# EAGLE design master-v13 (EAGLE 7.1.0)
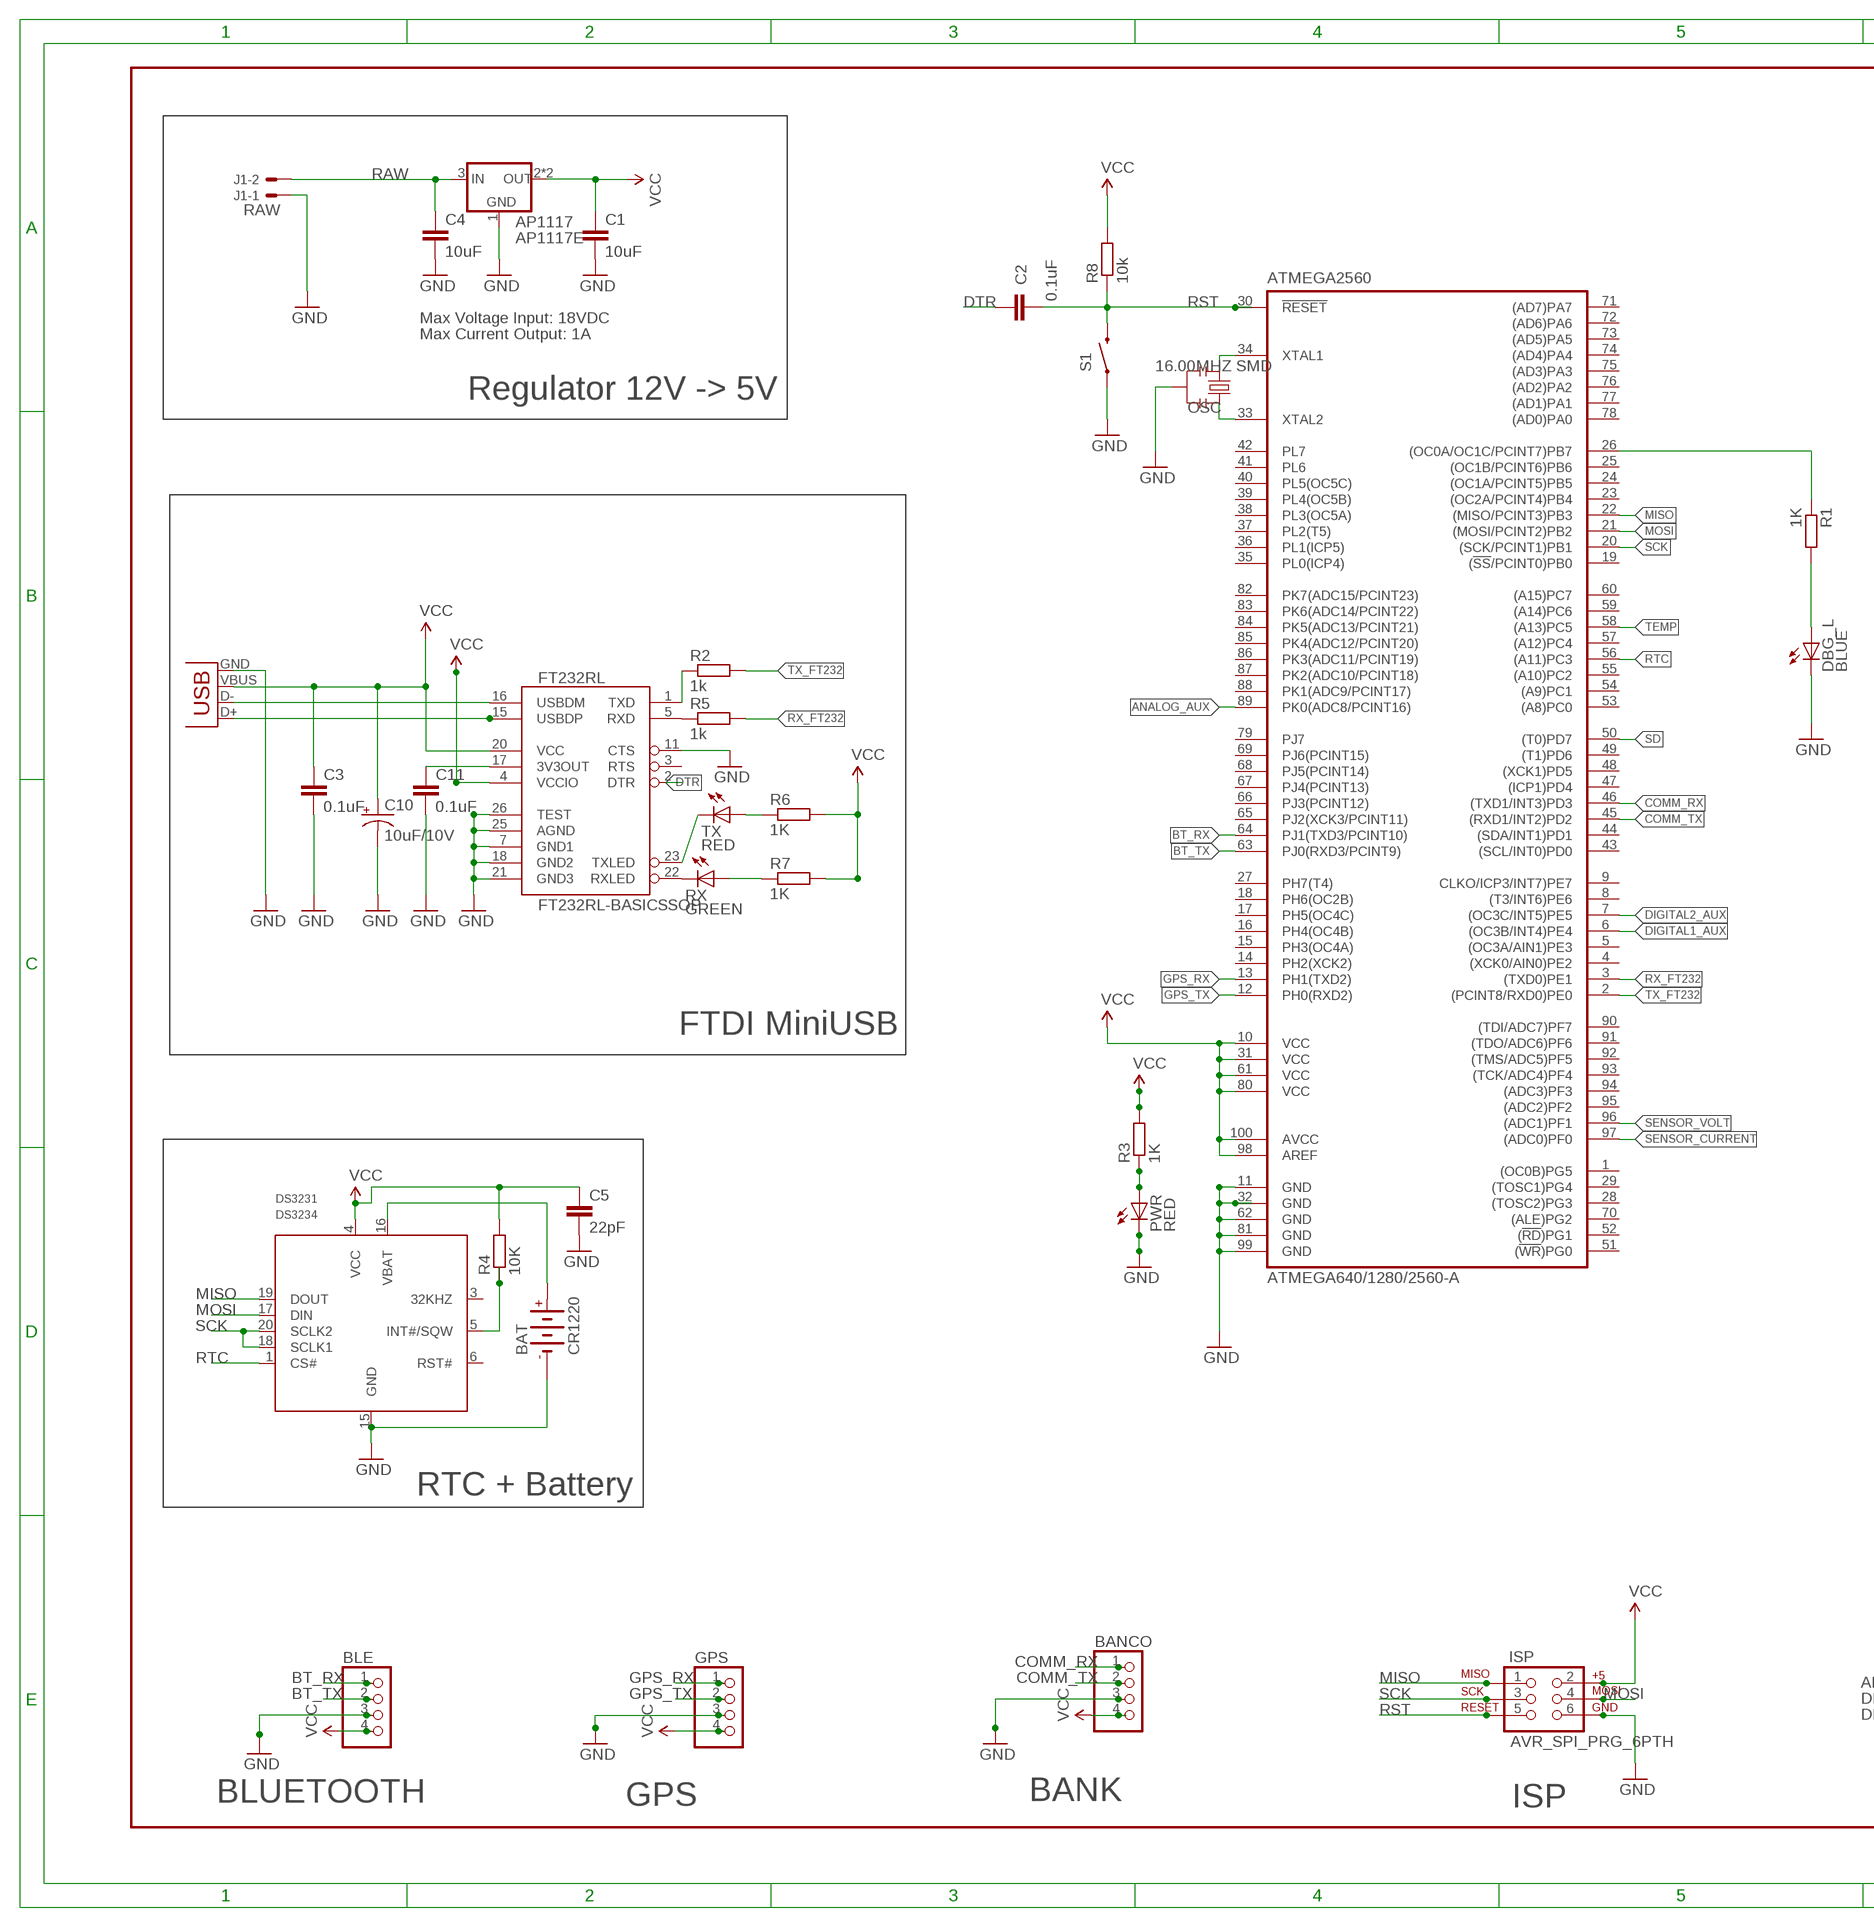
[diagram p0: schematic, sheet 1, part 1 of 2]
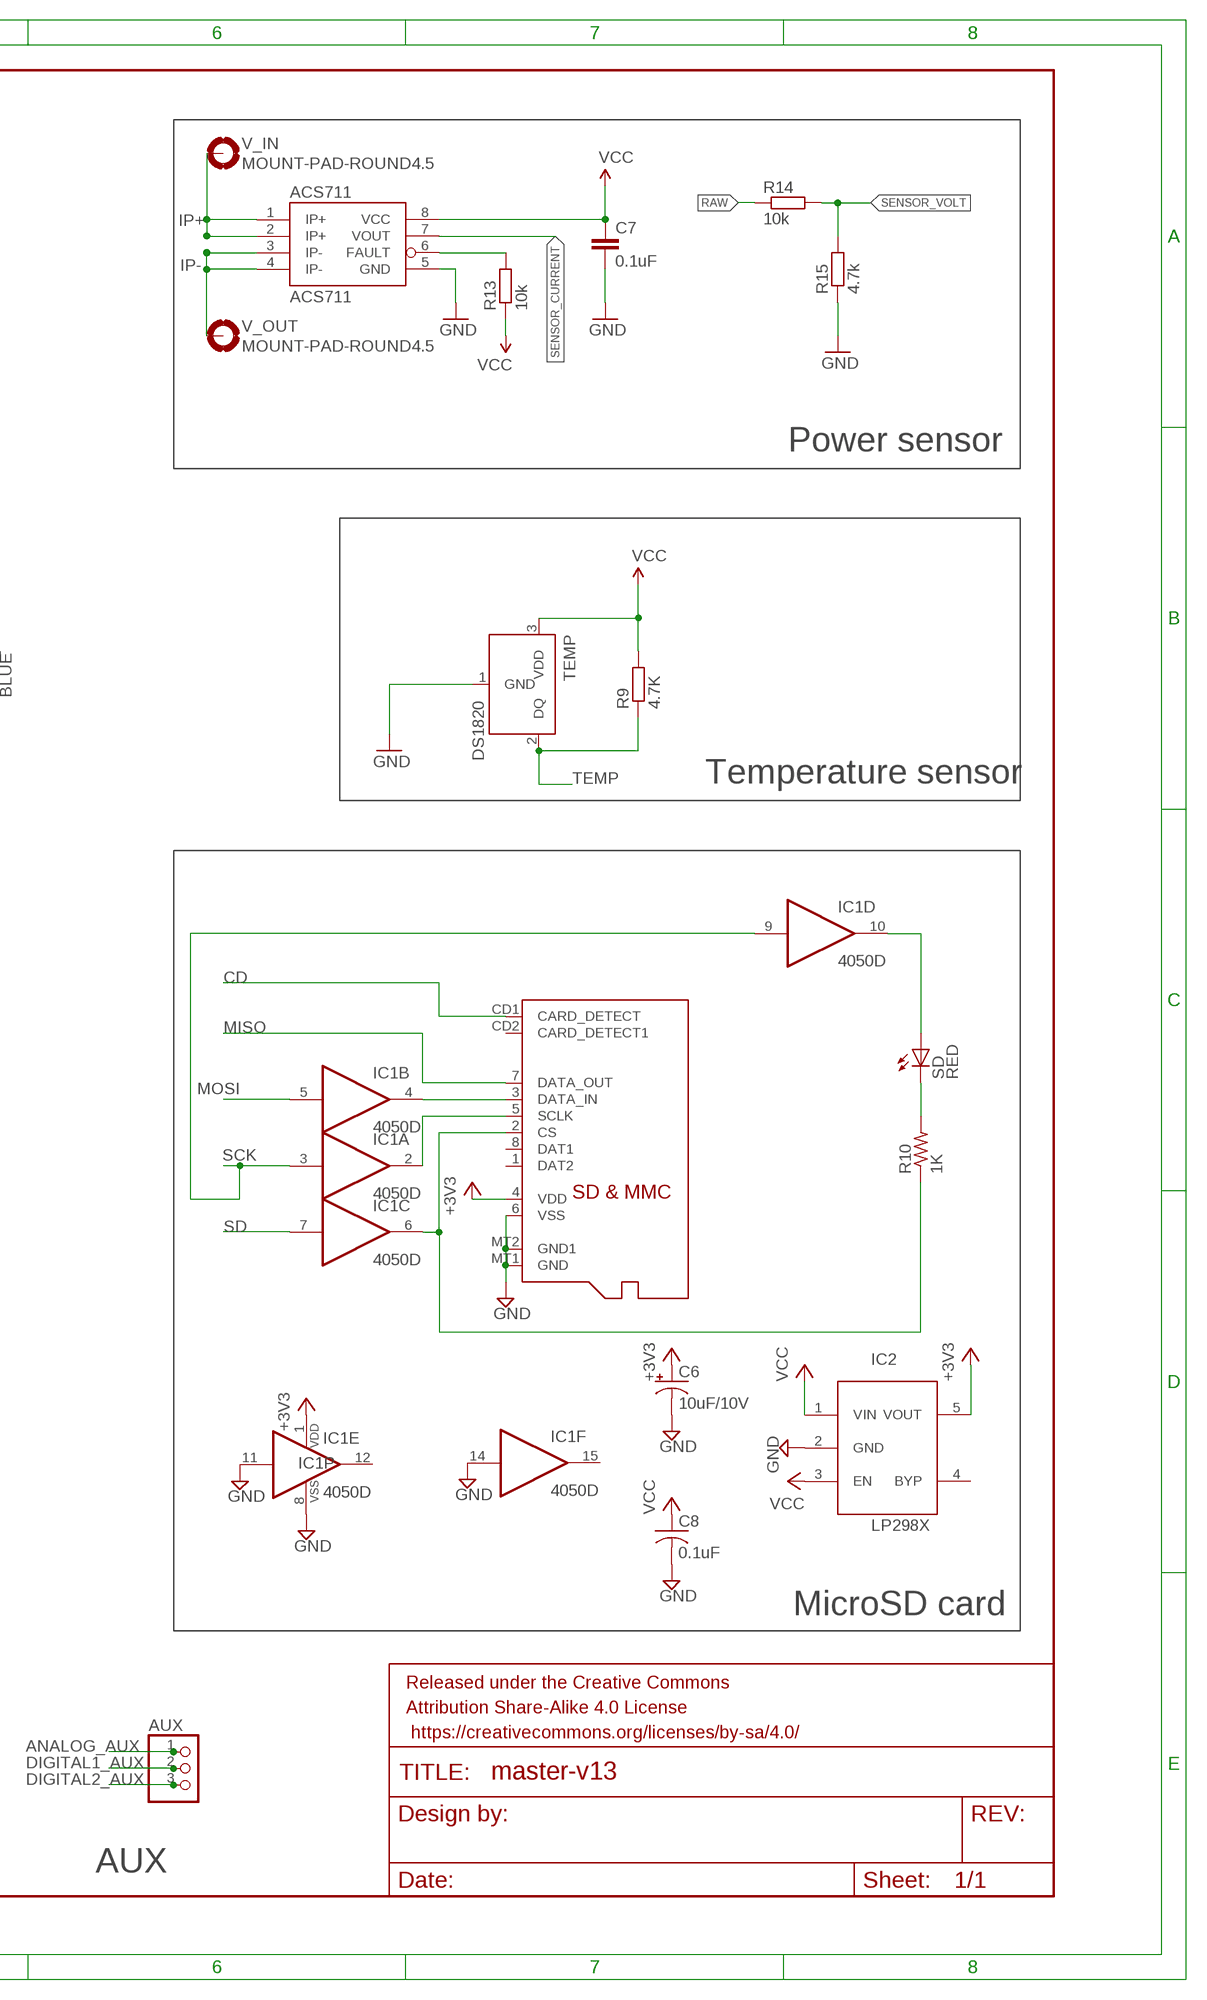
[diagram p1: schematic, sheet 1, part 2 of 2]

## Parts
ACS711  ACS711  [SOIC8]
AP1117  AP1117E  [SOT223]
ATMEGA2560  ATMEGA640/1280/2560-A  [TQFP100A]
AUX  PINHD-1X3  [1X03]
BANCO  PINHD-1X4  [1X04]
BAT  CR1220  [CR1220]
BLE  PINHD-1X4  [1X04]
C1  10uF  C-EUC0805K  [C0805K]
C2  0.1uF  C-EUC0805K  [C0805K]
C3  0.1uF  CAP0402-CAP  [0402-CAP]
C4  10uF  C-EUC0805K  [C0805K]
C5  22pF  CAP0402-CAP  [0402-CAP]
C6  10uF/10V  CPOL-USA/3216-18R  [A/3216-18R]
C7  0.1uF  C-EUC0805K  [C0805K]
C8  0.1uF  C-USC0805K  [C0805K]
C10  10uF/10V  CPOL-USA/3216-18R  [A/3216-18R]
C11  0.1uF  CAP0402-CAP  [0402-CAP]
DBG_L  BLUE  LEDCHIPLED_0805  [CHIPLED_0805]
DS3231  DS3234  [SO-20DW]
FRAME1  FRAME-LEDGER  [CREATIVE_COMMONS]
FT232RL  FT232RL-BASICSSOP  [SSOP28DB]
GPS  PINHD-1X4  [1X04]
IC1  4050D  [SO16]
IC2  LP298XS  [SOT23-5L]
ISP  AVR_SPI_PRG_6PTH  [2X3]
J1  RAW  22-05-7028-02  [7395-02]
OSC  16.00MHZ SMD  RESONATOR-SMD  [RESONATOR-SMD]
PWR  RED  LEDCHIPLED_0805  [CHIPLED_0805]
R1  1K  R-EU_R0805  [R0805]
R2  1k  R-EU_R0805  [R0805]
R3  1K  R-EU_R0805  [R0805]
R4  10K  R-EU_R0805  [R0805]
R5  1k  R-EU_R0805  [R0805]
R6  1K  R-EU_R0805  [R0805]
R7  1K  R-EU_R0805  [R0805]
R8  10k  R-EU_R0805  [R0805]
R9  4.7K  R-EU_R0805  [R0805]
R10  1K  R-US_R0805  [R0805]
R13  10k  R-EU_R0805  [R0805]
R14  10k  R-EU_R0805  [R0805]
R15  4.7k  R-EU_R0805  [R0805]
RX  GREEN  LEDCHIPLED_0805  [CHIPLED_0805]
S1  SWITCH-MOMENTARY-2-SMD-1101NE  [TACTILE-SWITCH-1101NE]
SD  RED  LEDCHIP-LED0805  [CHIP-LED0805]
TEMP  DS1820  [TO-92]
TX  RED  LEDCHIPLED_0805  [CHIPLED_0805]
V_IN  MOUNT-PAD-ROUND4.5  [4,5-PAD]
V_OUT  MOUNT-PAD-ROUND4.5  [4,5-PAD]
X1  USB-MB-H  [USB-MB-H]
X2  MICROSD  [MICROSD]

## Nets
+3V3: C6.+ IC1.1(P:VDD) IC2.5(VOUT) X2.4(VDD)
ANALOG_AUX: ATMEGA2560.89(PK0(ADC8/PCINT16)) AUX.1
BT_RX: ATMEGA2560.64(PJ1(TXD3/PCINT10)) BLE.1
BT_TX: ATMEGA2560.63(PJ0(RXD3/PCINT9)) BLE.2
CD: X2.CD1(CARD_DETECT)
COMM_RX: ATMEGA2560.46((TXD1/INT3)PD3) BANCO.1
COMM_TX: ATMEGA2560.45((RXD1/INT2)PD2) BANCO.2
DIGITAL1_AUX: ATMEGA2560.6((OC3B/INT4)PE4) AUX.2
DIGITAL2_AUX: ATMEGA2560.7((OC3C/INT5)PE5) AUX.3
DTR: C2.2 FT232RL.2(DTR)
GND [power]: ACS711.5(GND) AP1117.1(GND) ATMEGA2560.11(GND) ATMEGA2560.32(GND) ATMEGA2560.62(GND) ATMEGA2560.81(GND) ATMEGA2560.99(GND) BANCO.3 BAT.- BLE.3 C1.2 C3.2 C4.2 C5.2 C6.- C7.2 C8.2 C10.- C11.2 DBG_L.C DS3231.15(GND) FT232RL.7(GND1) FT232RL.11(CTS) FT232RL.18(GND2) FT232RL.21(GND3) FT232RL.25(AGND) FT232RL.26(TEST) GPS.3 IC1.8(P:VSS) IC1.11(E:I) IC1.14(F:I) IC2.2(GND) ISP.6 J1.1 OSC.2 PWR.C R15.1 S1.P$1 TEMP.1(GND) X1.GND X2.6(VSS) X2.MT1(GND) X2.MT2(GND1)
GPS_RX: ATMEGA2560.13(PH1(TXD2)) GPS.1
GPS_TX: ATMEGA2560.12(PH0(RXD2)) GPS.2
IP+: ACS711.1(IP+) ACS711.2(IP+) V_IN.B4,5(MOUNT)
IP-: ACS711.3(IP-) ACS711.4(IP-) V_OUT.B4,5(MOUNT)
MISO: ATMEGA2560.22((MISO/PCINT3)PB3) DS3231.19(DOUT) ISP.1 X2.7(DATA_OUT)
MOSI: ATMEGA2560.21((MOSI/PCINT2)PB2) DS3231.17(DIN) IC1.5(B:I) ISP.4
N$1: BAT.+ DS3231.16(VBAT)
N$2: ATMEGA2560.34(XTAL1) OSC.1
N$3: DBG_L.A R1.2
N$4: ATMEGA2560.26((OC0A/OC1C/PCINT7)PB7) R1.1
N$5: PWR.A R3.1
N$6: FT232RL.1(TXD) R2.1
N$7: DS3231.5(INT#/SQW) R4.1
N$8: FT232RL.5(RXD) R5.1
N$9: IC1.10(D:O) SD.A
N$10: FT232RL.22(RXLED) RX.C
N$11: R7.1 RX.A
N$12: FT232RL.23(TXLED) TX.C
N$13: R6.1 TX.A
N$14: ATMEGA2560.33(XTAL2) OSC.3
N$15: IC1.2(A:O) X2.5(SCLK)
N$16: IC1.6(C:O) R10.1 X2.2(CS)
N$17: R10.2 SD.C
N$18: IC1.4(B:O) X2.3(DATA_IN)
N$19 [power]: C11.1 FT232RL.17(3V3OUT)
N$69: ACS711.6(FAULT) R13.2
RAW [power]: AP1117.3(IN) C4.1 J1.2 R14.1
RST: ATMEGA2560.30(!RESET!) C2.1 ISP.5 R8.1 S1.P$2
RTC: ATMEGA2560.56((A11)PC3) DS3231.1(CS#)
RX_FT232: ATMEGA2560.3((TXD0)PE1) R5.2
SCK: ATMEGA2560.20((SCK/PCINT1)PB1) DS3231.18(SCLK1) DS3231.20(SCLK2) IC1.3(A:I) IC1.9(D:I) ISP.3
SD: ATMEGA2560.50((T0)PD7) IC1.7(C:I)
SENSOR_CURRENT: ACS711.7(VOUT) ATMEGA2560.97((ADC0)PF0)
SENSOR_VOLT: ATMEGA2560.96((ADC1)PF1) R14.2 R15.2
TEMP: ATMEGA2560.58((A13)PC5) R9.1 TEMP.2(DQ)
TX_FT232: ATMEGA2560.2((PCINT8/RXD0)PE0) R2.2
USB_D+1: FT232RL.15(USBDP) X1.D+
USB_D-1: FT232RL.16(USBDM) X1.D-
VCC [power]: ACS711.8(VCC) AP1117.2(OUT) AP1117.4(OUT) ATMEGA2560.10(VCC) ATMEGA2560.31(VCC) ATMEGA2560.61(VCC) ATMEGA2560.80(VCC) ATMEGA2560.98(AREF) ATMEGA2560.100(AVCC) BANCO.4 BLE.4 C1.1 C3.1 C5.1 C7.1 C8.1 C10.+ DS3231.4(VCC) FT232RL.4(VCCIO) FT232RL.20(VCC) GPS.4 IC2.1(VIN) IC2.3(EN) ISP.2 R3.2 R4.2 R6.2 R7.2 R8.2 R9.2 R13.1 TEMP.3(VDD) X1.VBUS
Unconnected: ATMEGA2560.1((OC0B)PG5) ATMEGA2560.4((XCK0/AIN0)PE2) ATMEGA2560.5((OC3A/AIN1)PE3) ATMEGA2560.8((T3/INT6)PE6) ATMEGA2560.9(CLKO/ICP3/INT7)PE7) ATMEGA2560.14(PH2(XCK2)) ATMEGA2560.15(PH3(OC4A)) ATMEGA2560.16(PH4(OC4B)) ATMEGA2560.17(PH5(OC4C)) ATMEGA2560.18(PH6(OC2B)) ATMEGA2560.19((!SS!/PCINT0)PB0) ATMEGA2560.23((OC2A/PCINT4)PB4) ATMEGA2560.24((OC1A/PCINT5)PB5) ATMEGA2560.25((OC1B/PCINT6)PB6) ATMEGA2560.27(PH7(T4)) ATMEGA2560.28((TOSC2)PG3) ATMEGA2560.29((TOSC1)PG4) ATMEGA2560.35(PL0(ICP4)) ATMEGA2560.36(PL1(ICP5)) ATMEGA2560.37(PL2(T5)) ATMEGA2560.38(PL3(OC5A)) ATMEGA2560.39(PL4(OC5B)) ATMEGA2560.40(PL5(OC5C)) ATMEGA2560.41(PL6) ATMEGA2560.42(PL7) ATMEGA2560.43((SCL/INT0)PD0) ATMEGA2560.44((SDA/INT1)PD1) ATMEGA2560.47((ICP1)PD4) ATMEGA2560.48((XCK1)PD5) ATMEGA2560.49((T1)PD6) ATMEGA2560.51((!WR!)PG0) ATMEGA2560.52((!RD!)PG1) ATMEGA2560.53((A8)PC0) ATMEGA2560.54((A9)PC1) ATMEGA2560.55((A10)PC2) ATMEGA2560.57((A12)PC4) ATMEGA2560.59((A14)PC6) ATMEGA2560.60((A15)PC7) ATMEGA2560.65(PJ2(XCK3/PCINT11)) ATMEGA2560.66(PJ3(PCINT12)) ATMEGA2560.67(PJ4(PCINT13)) ATMEGA2560.68(PJ5(PCINT14)) ATMEGA2560.69(PJ6(PCINT15)) ATMEGA2560.70((ALE)PG2) ATMEGA2560.71((AD7)PA7) ATMEGA2560.72((AD6)PA6) ATMEGA2560.73((AD5)PA5) ATMEGA2560.74((AD4)PA4) ATMEGA2560.75((AD3)PA3) ATMEGA2560.76((AD2)PA2) ATMEGA2560.77((AD1)PA1) ATMEGA2560.78((AD0)PA0) ATMEGA2560.79(PJ7) ATMEGA2560.82(PK7(ADC15/PCINT23)) ATMEGA2560.83(PK6(ADC14/PCINT22)) ATMEGA2560.84(PK5(ADC13/PCINT21)) ATMEGA2560.85(PK4(ADC12/PCINT20)) ATMEGA2560.86(PK3(ADC11/PCINT19)) ATMEGA2560.87(PK2(ADC10/PCINT18)) ATMEGA2560.88(PK1(ADC9/PCINT17)) ATMEGA2560.90((TDI/ADC7)PF7) ATMEGA2560.91((TDO/ADC6)PF6) ATMEGA2560.92((TMS/ADC5)PF5) ATMEGA2560.93((TCK/ADC4)PF4) ATMEGA2560.94((ADC3)PF3) ATMEGA2560.95((ADC2)PF2) DS3231.3(32KHZ) DS3231.6(RST#) FT232RL.3(RTS) IC1.12(E:O) IC1.15(F:O) IC2.4(BYP) X2.1(DAT2) X2.8(DAT1) X2.CD2(CARD_DETECT1)

## Notes on the sheet
- Max Voltage Input: 18VDC
- Max Current Output: 1A
- Regulator 12V -> 5V
- Power sensor
- Temperature sensor
- FTDI MiniUSB
- RTC + Battery
- MicroSD card
- BLUETOOTH | GPS | BANK | ISP | AUX

## Library data of the parts
ACS711 = ACS711:ACS711: Hall-effect-based isolated linear current sensor; MPN: ACS711KLCTR-25AB-T; OC_NEWARK: 24T5972
AP1117 = v-reg:AP1117: LDO Regulator; MPN: AP1117E50G-13; OC_NEWARK: 79R5846
ATMEGA2560 = atmel-avr:ATMEGA640/1280/2560: MICROCONTROLLER 64K/128K/256K Flash 8K Bytes Internal SRAM 4K Bytes EEPROM; OC_NEWARK: unknown
AUX = pinhead:PINHD-1X3: PIN HEADER; OC_NEWARK: unknown
BANCO BLE GPS = pinhead:PINHD-1X4: PIN HEADER; OC_NEWARK: unknown
BAT = battery:CR1220: LI BATTERY Panasonic; MF: SANYO, HAWKER, PANASONIC BATTE; MPN: CR1220; OC_NEWARK: 15C6530
C1 C4 = rcl:C-EU: CAPACITOR, European symbol; MPN: 0805ZD106KAT2A; OC_NEWARK: 96M1311
C2 C7 = rcl:C-EU: CAPACITOR, European symbol; MPN: MC0603B104K500CT; OC_NEWARK: 06R4927
C3 C5 C11 = SparkFun:CAP: Capacitor Standard 0603 ceramic capacitor, and 0.1" leaded capacitor.; MPN: MC0603B104K500CT; OC_NEWARK: 06R4927
C6 C10 = adafruit:CPOL-US: POLARIZED CAPACITOR, American symbol; MPN: TAJP106M010RNJ; OC_NEWARK: 60R6049
C8 = adafruit:C-US: CAPACITOR, American symbol; MPN: MC0603B104K500CT; OC_NEWARK: 06R4927
DBG_L = adafruit:LED: LED OSRAM: - CHIPLED LG R971, LG N971, LY N971, LG Q971, LY Q971, LO R971, LY R971 LH N974, LH R974 LS Q976, LO Q976, LY Q976 LO Q996 - Hyper CHIPLED LW Q18S LB Q993, LB Q99A, LB R99A - SideLED LS A670, LO A670, LY A670, LG A670, LP A670 LB A673, LV A673, LT A673, LW A673 LH A674 LY A675 LS A676, LA A676, LO A676, LY A676, LW A676 LS A679, LY A679, LG A679 - Hyper Micro SIDELED® LS Y876, LA Y876, LO Y876, LY Y876 LT Y87S - SmartLED LW L88C, LW L88S LB L89C, LB L89S, LG L890 LS L89K, LO L89K, LY L89K LS L896, LA L896, LO L896, LY L896 - TOPLED LS T670, LO T670, LY T670, LG T670, LP T670 LSG T670, LSP T670, LSY T670, LOP T670, LYG T670 LG T671, LOG T671, LSG T671 LB T673, LV T673, LT T673, LW T673 LH T674 LS T676, LA T676, LO T676, LY T676, LB T676, LH T676, LSB T676, LW T676 LB T67C, LV T67C, LT T67C, LS T67K, LO T67K, LY T67K, LW E67C LS E67B, LA E67B, LO E67B, LY E67B, LB E67C, LV E67C, LT E67C LW T67C LS T679, LY T679, LG T679 LS T770, LO T770, LY T770, LG T770, LP T770 LB T773, LV T773, LT T773, LW T773 LH T774 LS E675, LA E675, LY E675, LS T675 LS T776, LA T776, LO T776, LY T776, LB T776 LHGB T686 LT T68C, LB T68C - Hyper Mini TOPLED® LB M676 - Mini TOPLED Santana® LG M470 LS M47K, LO M47K, LY M47K Source: http://www.osram.convergy.de/; MPN: 150080BS75000; OC_NEWARK: 95W3799
DS3231 = 0-ds3234:DS3234*: Extremely Accurate SPI Bus RTC with Integrated Crystal and SRAM The DS3234 is a low-cost, extremely accurate SPI? bus real-time clock (RTC) with an integrated temperature-com- pensated crystal oscillator (TCXO) and crystal. The DS3234 incorporates a precision, temperature-compen- sated voltage reference and comparator circuit to monitor VCC. When VCCdrops below the power-fail voltage (VPF), the device asserts the RSToutput and also disables read and write access to the part when VCCdrops below both VPFand VBAT. The RSTpin is monitored as a pushbutton input for generating a µP reset. The device switches to the backup supply input and maintains accurate timekeeping when main power to the device is interrupted. The integra- tion of the crystal resonator enhances the long-term accu- racy of the device as well as reduces the piece-part count in a manufacturing line. The DS3234 is available in com- mercial and industrial temperature ranges, and is offered in an industry-standard 300-mil, 20-pin SO package. The DS3234 also integrates 256 bytes of battery-backed SRAM. In the event of main power loss, the contents of the memory are maintained by the power source con- nected to the VBATpin. The RTC maintains seconds, minutes, hours, day, date, month, and year information. The date at the end of the month is automatically adjust- ed for months with fewer than 31 days, including correc- tions for leap year. The clock operates in either the 24-hour or 12-hour format with AM/PM indicator. Two programmable time-of-day alarms and a programmable square-wave output are provided. Address and data are transferred serially by an SPI bidirectional bus. Accuracy ±2ppm from 0°C to +40°C Accuracy ±3.5ppm from -40°C to +85°C Battery Backup Input for Continuous Timekeeping Operating Temperature Ranges Commercial: 0°C to +70°C Industrial: -40°C to +85°C Low-Power Consumption Real-Time Clock Counts Seconds, Minutes, Hours, Day, Date, Month, and Year with Leap Year Compensation Valid Up to 2099 Two Time-of-Day Alarms Programmable Square-Wave Output 4MHz SPI Bus Supports Modes 1 and 3 Digital Temp Sensor Output: ±3°C Accuracy Register for Aging Trim RSTInput/Output 300-Mil, 20-Pin SO Package Underwriters Laboratories (UL®) Recognized; OC_NEWARK: unknown
FRAME1 = SparkFun-Aesthetics:FRAME-LEDGER: Schematic Frame Standard 11x14 US Ledger frame; OC_NEWARK: unknown
FT232RL = SparkFun-DigitalIC:FT232RL-BASIC: USB UART This is the simplified version of the FT232RL unit. Only what you need, nothing you don't. Spark Fun Electronics SKU : COM-00650; OC_NEWARK: unknown
IC1 = 40xx:4050: Hex non-inverting BUFFER; MPN: 74HC4050D,653; OC_NEWARK: 93X4897
IC2 = adafruit:LP298X; OC_NEWARK: unknown
ISP = SparkFun-Connectors:AVR_SPI_PRG_6: AVR ISP 6 Pin This is the reduced ISP connector for AVR programming. Common on Arduino. This footprint will take up less PCB space and can be used with a 10-pin to 6-pin adapter such as SKU: BOB-08508; OC_NEWARK: unknown
J1 = con-molex:22-?-02: CONNECTOR wire to board 2.54 mm (.1 inch) pitch header; OC_FARNELL: 9731601; OC_NEWARK: unknown
OSC = resonador:RESONATOR-: Resonator Small SMD resonator. This is the itty bitty 10/20MHz resonators with built in caps. CSTCE10M0G55 and CSTCE20M0V53. Footprint has been reviewed closely but hasn't been tested yet.; MPN: PBRC8.00HR50X000; OC_NEWARK: unknown
PWR TX = adafruit:LED: LED OSRAM: - CHIPLED LG R971, LG N971, LY N971, LG Q971, LY Q971, LO R971, LY R971 LH N974, LH R974 LS Q976, LO Q976, LY Q976 LO Q996 - Hyper CHIPLED LW Q18S LB Q993, LB Q99A, LB R99A - SideLED LS A670, LO A670, LY A670, LG A670, LP A670 LB A673, LV A673, LT A673, LW A673 LH A674 LY A675 LS A676, LA A676, LO A676, LY A676, LW A676 LS A679, LY A679, LG A679 - Hyper Micro SIDELED® LS Y876, LA Y876, LO Y876, LY Y876 LT Y87S - SmartLED LW L88C, LW L88S LB L89C, LB L89S, LG L890 LS L89K, LO L89K, LY L89K LS L896, LA L896, LO L896, LY L896 - TOPLED LS T670, LO T670, LY T670, LG T670, LP T670 LSG T670, LSP T670, LSY T670, LOP T670, LYG T670 LG T671, LOG T671, LSG T671 LB T673, LV T673, LT T673, LW T673 LH T674 LS T676, LA T676, LO T676, LY T676, LB T676, LH T676, LSB T676, LW T676 LB T67C, LV T67C, LT T67C, LS T67K, LO T67K, LY T67K, LW E67C LS E67B, LA E67B, LO E67B, LY E67B, LB E67C, LV E67C, LT E67C LW T67C LS T679, LY T679, LG T679 LS T770, LO T770, LY T770, LG T770, LP T770 LB T773, LV T773, LT T773, LW T773 LH T774 LS E675, LA E675, LY E675, LS T675 LS T776, LA T776, LO T776, LY T776, LB T776 LHGB T686 LT T68C, LB T68C - Hyper Mini TOPLED® LB M676 - Mini TOPLED Santana® LG M470 LS M47K, LO M47K, LY M47K Source: http://www.osram.convergy.de/; MPN: KPT-2012SRC-J4; OC_NEWARK: 88W4951
R1-R7 = rcl:R-EU_: RESISTOR, European symbol; MF: VISHAY/DALE; MPN: CRCW08051K00FKTA; OC_NEWARK: 05F1507
R8 R9 R13 R14 = rcl:R-EU_: RESISTOR, European symbol; MF: VISHAY/DALE; MPN: CRCW080510K0FKTA; OC_NEWARK: 05F1511
R10 = adafruit:R-US_: RESISTOR, American symbol; MF: VISHAY/DALE; MPN: CRCW08051K00FKTA; OC_NEWARK: 05F1507
R15 = rcl:R-EU_: RESISTOR, European symbol; MF: VISHAY/DALE; MPN: CRCW08053K30FKTA; OC_NEWARK: 48F4423
RX = adafruit:LED: LED OSRAM: - CHIPLED LG R971, LG N971, LY N971, LG Q971, LY Q971, LO R971, LY R971 LH N974, LH R974 LS Q976, LO Q976, LY Q976 LO Q996 - Hyper CHIPLED LW Q18S LB Q993, LB Q99A, LB R99A - SideLED LS A670, LO A670, LY A670, LG A670, LP A670 LB A673, LV A673, LT A673, LW A673 LH A674 LY A675 LS A676, LA A676, LO A676, LY A676, LW A676 LS A679, LY A679, LG A679 - Hyper Micro SIDELED® LS Y876, LA Y876, LO Y876, LY Y876 LT Y87S - SmartLED LW L88C, LW L88S LB L89C, LB L89S, LG L890 LS L89K, LO L89K, LY L89K LS L896, LA L896, LO L896, LY L896 - TOPLED LS T670, LO T670, LY T670, LG T670, LP T670 LSG T670, LSP T670, LSY T670, LOP T670, LYG T670 LG T671, LOG T671, LSG T671 LB T673, LV T673, LT T673, LW T673 LH T674 LS T676, LA T676, LO T676, LY T676, LB T676, LH T676, LSB T676, LW T676 LB T67C, LV T67C, LT T67C, LS T67K, LO T67K, LY T67K, LW E67C LS E67B, LA E67B, LO E67B, LY E67B, LB E67C, LV E67C, LT E67C LW T67C LS T679, LY T679, LG T679 LS T770, LO T770, LY T770, LG T770, LP T770 LB T773, LV T773, LT T773, LW T773 LH T774 LS E675, LA E675, LY E675, LS T675 LS T776, LA T776, LO T776, LY T776, LB T776 LHGB T686 LT T68C, LB T68C - Hyper Mini TOPLED® LB M676 - Mini TOPLED Santana® LG M470 LS M47K, LO M47K, LY M47K Source: http://www.osram.convergy.de/; MPN: 150080VS75000; OC_NEWARK: 95W3803
S1 = SparkFun-Electromechanical:SWITCH-MOMENTARY-2: Various NO switches- pushbuttons, reed, etc; OC_NEWARK: unknown
SD = adafruit:LED: LED OSRAM: - CHIPLED LG R971, LG N971, LY N971, LG Q971, LY Q971, LO R971, LY R971 LH N974, LH R974 LS Q976, LO Q976, LY Q976 LO Q996 - Hyper CHIPLED LW Q18S LB Q993, LB Q99A, LB R99A - SideLED LS A670, LO A670, LY A670, LG A670, LP A670 LB A673, LV A673, LT A673, LW A673 LH A674 LY A675 LS A676, LA A676, LO A676, LY A676, LW A676 LS A679, LY A679, LG A679 - Hyper Micro SIDELED® LS Y876, LA Y876, LO Y876, LY Y876 LT Y87S - SmartLED LW L88C, LW L88S LB L89C, LB L89S, LG L890 LS L89K, LO L89K, LY L89K LS L896, LA L896, LO L896, LY L896 - TOPLED LS T670, LO T670, LY T670, LG T670, LP T670 LSG T670, LSP T670, LSY T670, LOP T670, LYG T670 LG T671, LOG T671, LSG T671 LB T673, LV T673, LT T673, LW T673 LH T674 LS T676, LA T676, LO T676, LY T676, LB T676, LH T676, LSB T676, LW T676 LB T67C, LV T67C, LT T67C, LS T67K, LO T67K, LY T67K, LW E67C LS E67B, LA E67B, LO E67B, LY E67B, LB E67C, LV E67C, LT E67C LW T67C LS T679, LY T679, LG T679 LS T770, LO T770, LY T770, LG T770, LP T770 LB T773, LV T773, LT T773, LW T773 LH T774 LS E675, LA E675, LY E675, LS T675 LS T776, LA T776, LO T776, LY T776, LB T776 LHGB T686 LT T68C, LB T68C - Hyper Mini TOPLED® LB M676 - Mini TOPLED Santana® LG M470 LS M47K, LO M47K, LY M47K Source: http://www.osram.convergy.de/; OC_NEWARK: unknown
TEMP = DS1820:DS1820: DS1820 - 1-Wire Digital Thermometer; MPN: MCP9808-E/MS; OC_NEWARK: 89T8871
V_IN V_OUT = holes:MOUNT-PAD-ROUND: MOUNTING PAD, round; OC_NEWARK: unknown
X1 = SparkFun:USB: USB Connectors USB-B-PTH is fully proven SKU : PRT-00139 USB-miniB is fully proven SKU : PRT-00587 USB-A-PCB is untested. USB-A-H is throughly reviewed, but untested. Spark Fun Electronics SKU : PRT-00437 USB-B-SMT is throughly reviewed, but untested. Needs silkscreen touching up. USB-A-S has not been used/tested USB-MB-H has not been used/tested; OC_NEWARK: unknown
X2 = adafruit:MICROSD: Micro-SD / Transflash card holder with SPI pinout For the 3M # 2908-05WB-MG and/or 4UCON #19656 push-push type; MPN: 2908-05WB-MG; OC_NEWARK: 28M0115

## Net classes
0 default: width 0.203 mm
1 power: width 0.254 mm

## Board
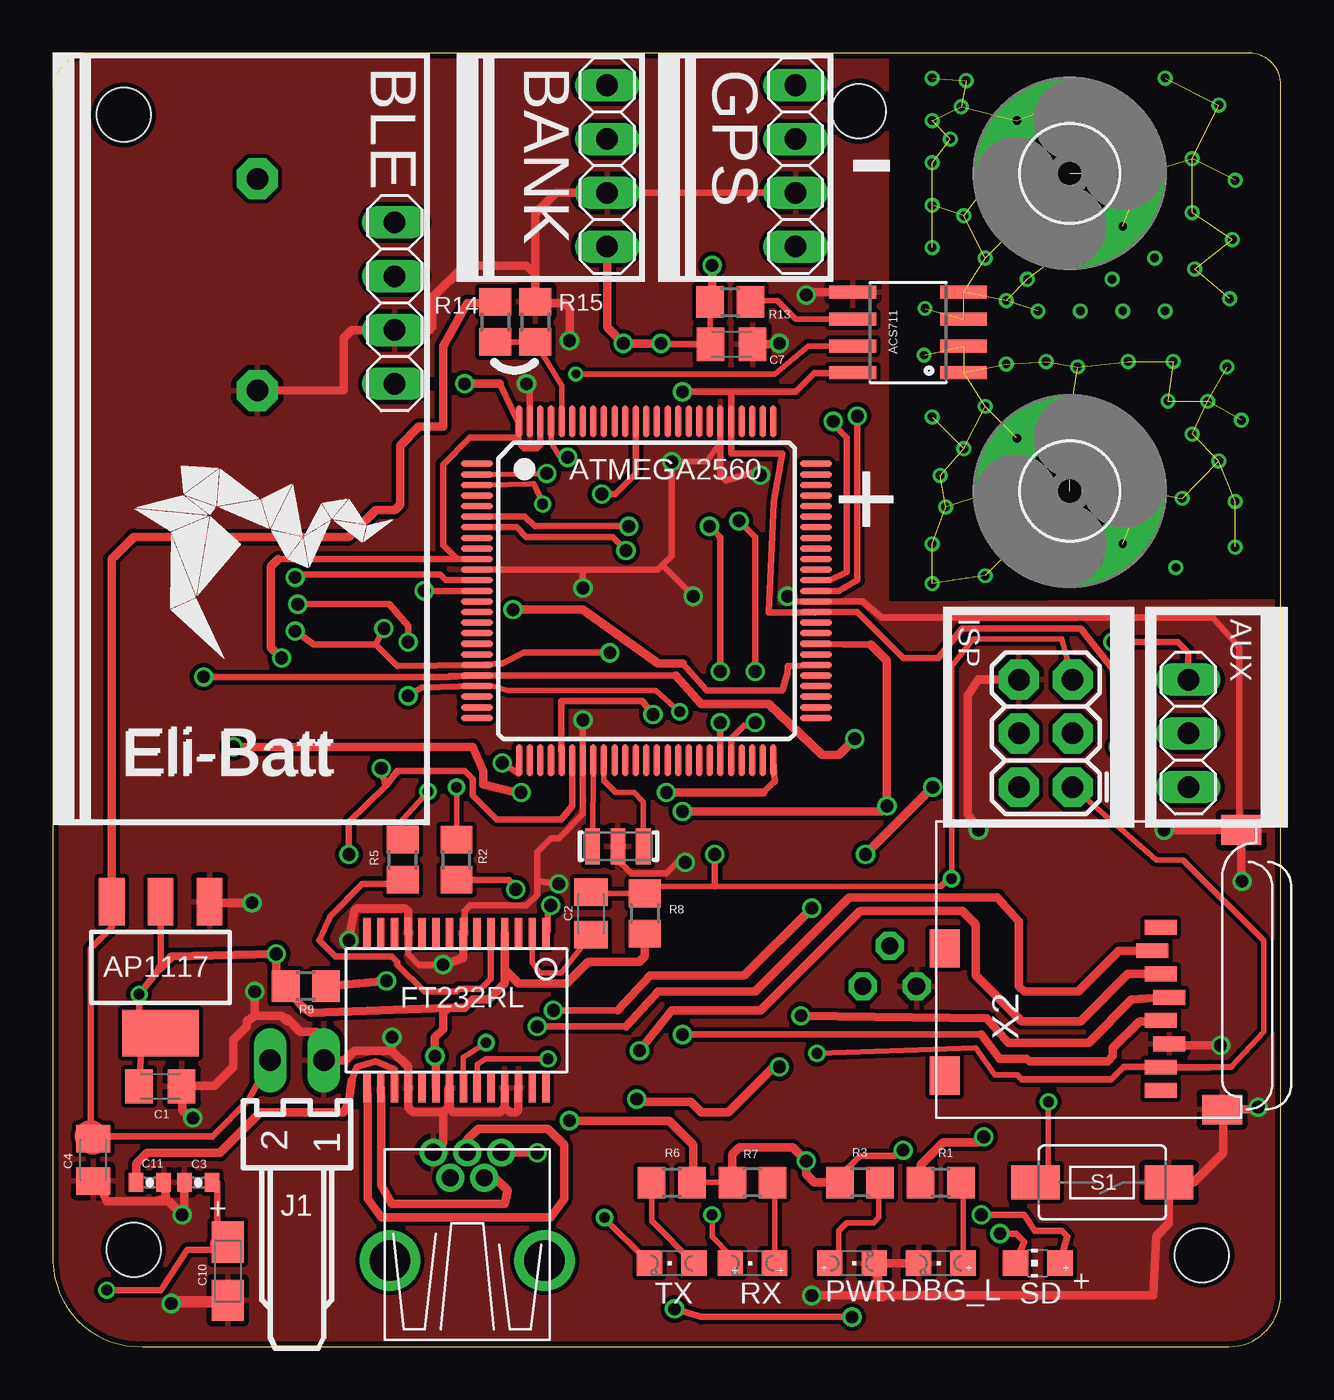
[diagram p2: board, top side]
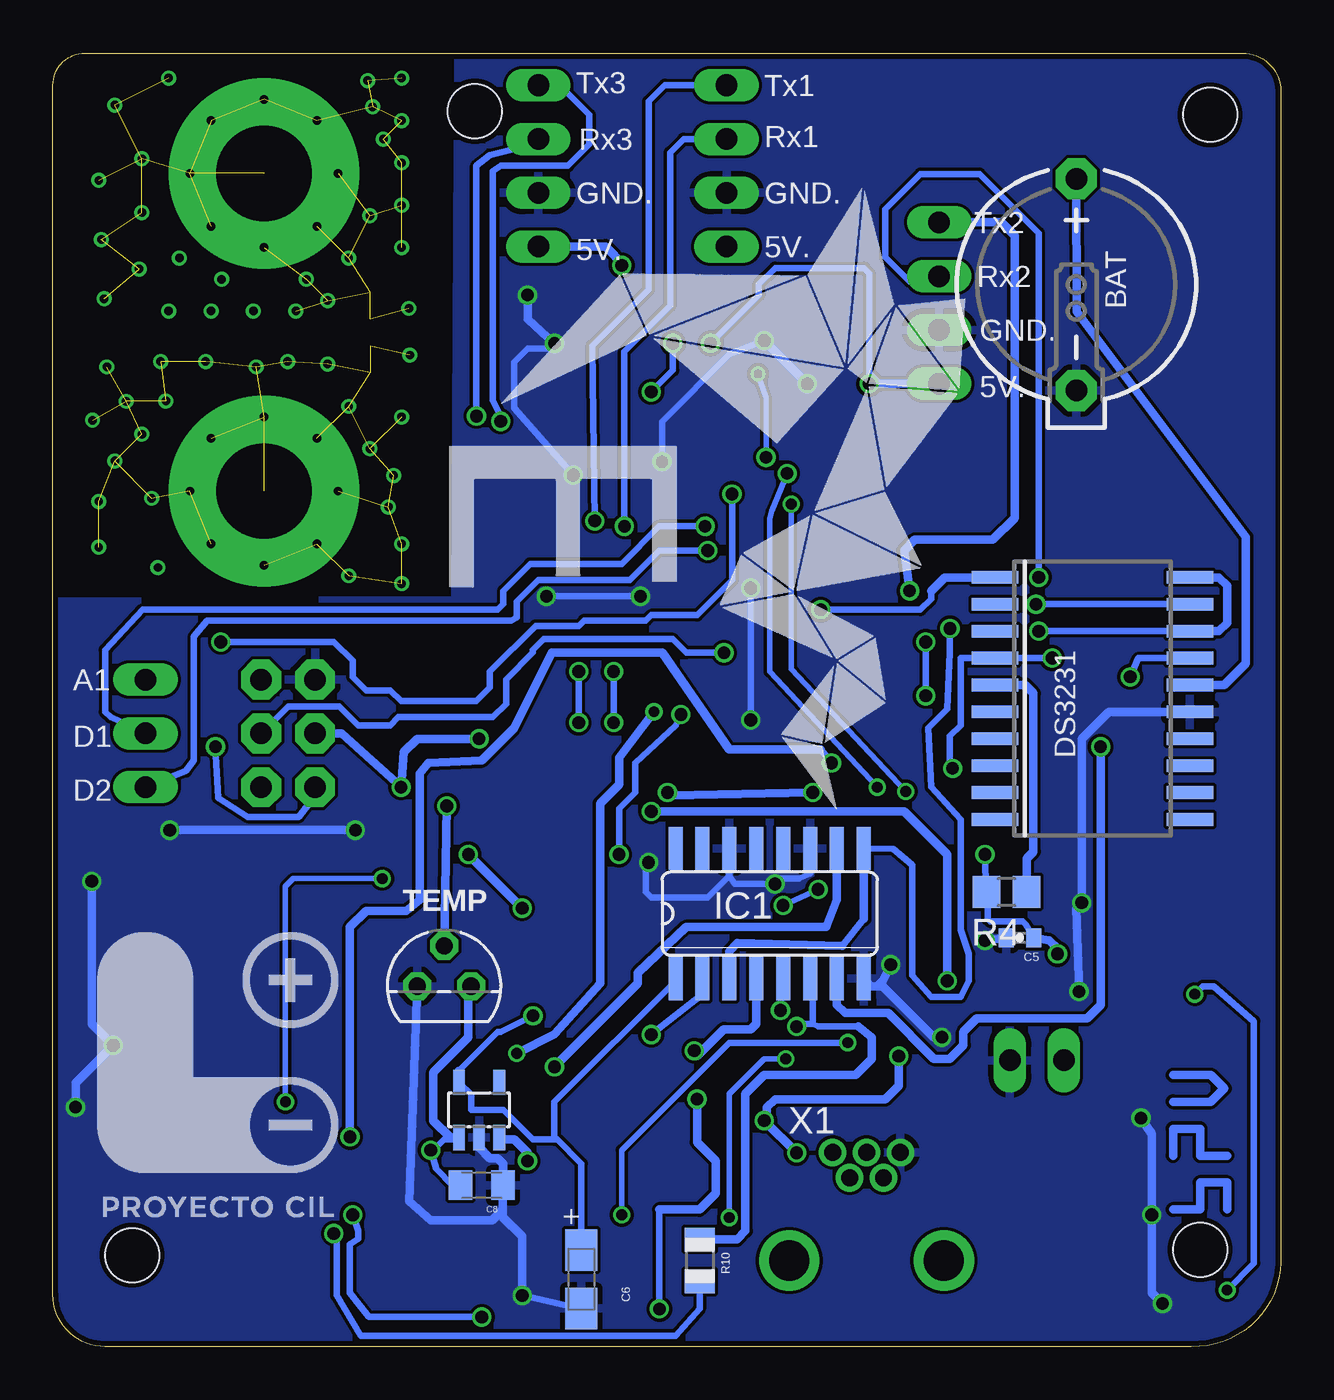
[diagram p3: board, bottom side, seen from below]

Size 57.96 x 61.08 mm. Coordinates in mm from the lower left corner, seen from the top.
Outline: 0,59.29 0,3.98 arc90 4.23,0 55.51,0 arc90 57.96,2.45 57.96,59.58 arc90 56.46,61.08 1.79,61.08 arc90 0,59.29
Copper layers (1*16): Top 0.035mm / dielectric 1.5mm / Bottom 0.035mm
Design rules "ITEADstudio_DRC": minimum track width 6mil, minimum drill 12mil, track to track 6mil, track to pad 6mil, pad to pad 6mil, via to via 6mil, smd to smd 0mil, copper to edge 10mil, drill to drill 10mil, minimum pad ring 10mil, minimum via ring 6mil, stop-mask expansion 2mil, vias tented up to drill 100mil, thermal gap 10mil
Holes 2.54 mm at 3.34,58.17 54.23,4.32 38.05,58.34 3.81,4.57

### Footprints (pad centres in the part's own frame; a part is rotated, then mirrored left to right if it is on the bottom)
SOIC8 = smd 0.61 x 2.21: 1 -1.905,-2.616; 2 -0.635,-2.616; 3 0.635,-2.616; 4 1.905,-2.616; 5 1.905,2.616; 6 0.635,2.616; 7 -0.635,2.616; 8 -1.905,2.616
SOT223 = smd 1.219 x 2.235: 1 -2.311,-3.099; 2 0,-3.099; 3 2.311,-3.099 | smd 3.6 x 2.2: 4 0,3.099
TQFP100A = smd 1.5 x 0.3: 1 -8,6; 2 -8,5.5; 3 -8,5; 4 -8,4.5; 5 -8,4; 6 -8,3.5; 7 -8,3; 8 -8,2.5; 9 -8,2; 10 -8,1.5; 11 -8,1; 12 -8,0.5; 13 -8,0; 14 -8,-0.5; 15 -8,-1; 16 -8,-1.5; 17 -8,-2; 18 -8,-2.5; 19 -8,-3; 20 -8,-3.5; 21 -8,-4; 22 -8,-4.5; 23 -8,-5; 24 -8,-5.5; 25 -8,-6; 51 8,-6; 52 8,-5.5; 53 8,-5; 54 8,-4.5; 55 8,-4; 56 8,-3.5; 57 8,-3; 58 8,-2.5; 59 8,-2; 60 8,-1.5; 61 8,-1; 62 8,-0.5; 63 8,0; 64 8,0.5; 65 8,1; 66 8,1.5; 67 8,2; 68 8,2.5; 69 8,3; 70 8,3.5; 71 8,4; 72 8,4.5; 73 8,5; 74 8,5.5; 75 8,6 | smd 0.3 x 1.5: 26 -6,-8; 27 -5.5,-8; 28 -5,-8; 29 -4.5,-8; 30 -4,-8; 31 -3.5,-8; 32 -3,-8; 33 -2.5,-8; 34 -2,-8; 35 -1.5,-8; 36 -1,-8; 37 -0.5,-8; 38 0,-8; 39 0.5,-8; 40 1,-8; 41 1.5,-8; 42 2,-8; 43 2.5,-8; 44 3,-8; 45 3.5,-8; 46 4,-8; 47 4.5,-8; 48 5,-8; 49 5.5,-8; 50 6,-8; 76 6,8; 77 5.5,8; 78 5,8; 79 4.5,8; 80 4,8; 81 3.5,8; 82 3,8; 83 2.5,8; 84 2,8; 85 1.5,8; 86 1,8; 87 0.5,8; 88 0,8; 89 -0.5,8; 90 -1,8; 91 -1.5,8; 92 -2,8; 93 -2.5,8; 94 -3,8; 95 -3.5,8; 96 -4,8; 97 -4.5,8; 98 -5,8; 99 -5.5,8; 100 -6,8
1X03 = drill 1.016 long: 1 -2.54,0; 2 0,0; 3 2.54,0
1X04 = drill 1.016 long: 1 -3.81,0; 2 -1.27,0; 3 1.27,0; 4 3.81,0
CR1220 = drill 1.016 pad 1.93 octagon: + -5,0; - 5,0
C0805K = smd 1.3 x 1.6: 1 -1,0; 2 1,0
0402-CAP = smd 0.7 x 0.9: 1 -0.65,0; 2 0.65,0
A/3216-18R = smd 1.95 x 1.5: + 1.375,0; - -1.375,0
C0805K' = smd 1.1 x 1.4: 1 -1,0; 2 1,0
CHIPLED_0805 = smd 1.2 x 1.2: A 0,-1.05; C 0,1.05
SO-20DW = smd 0.6 x 2.2: 1 -5.715,-4.6; 2 -4.445,-4.6; 3 -3.175,-4.6; 4 -1.905,-4.6; 5 -0.635,-4.6; 6 0.635,-4.6; 7 1.905,-4.6; 8 3.175,-4.6; 9 4.445,-4.6; 10 5.715,-4.6; 11 5.715,4.6; 12 4.445,4.6; 13 3.175,4.6; 14 1.905,4.6; 15 0.635,4.6; 16 -0.635,4.6; 17 -1.905,4.6; 18 -3.175,4.6; 19 -4.445,4.6; 20 -5.715,4.6
SSOP28DB = smd 0.348 x 1.397: 1 -4.225,-3.656; 2 -3.575,-3.656; 3 -2.925,-3.656; 4 -2.275,-3.656; 5 -1.625,-3.656; 6 -0.975,-3.656; 7 -0.325,-3.656; 8 0.325,-3.656; 9 0.975,-3.656; 10 1.625,-3.656; 11 2.275,-3.656; 12 2.925,-3.656; 13 3.575,-3.656; 14 4.225,-3.656; 15 4.225,3.656; 16 3.575,3.656; 17 2.925,3.656; 18 2.275,3.656; 19 1.625,3.656; 20 0.975,3.656; 21 0.325,3.656; 22 -0.325,3.656; 23 -0.975,3.656; 24 -1.625,3.656; 25 -2.275,3.656; 26 -2.925,3.656; 27 -3.575,3.656; 28 -4.225,3.656
SO16 = smd 0.66 x 2.032: 1 -4.445,-3.073; 2 -3.175,-3.073; 3 -1.905,-3.073; 4 -0.635,-3.073; 5 0.635,-3.073; 6 1.905,-3.073; 7 3.175,-3.073; 8 4.445,-3.073; 9 4.445,3.073; 10 3.175,3.073; 11 1.905,3.073; 12 0.635,3.073; 13 -0.635,3.073; 14 -1.905,3.073; 15 -3.175,3.073; 16 -4.445,3.073
SOT23-5L = smd 0.55 x 1.2: 1 -0.95,-1.3; 2 0,-1.3; 3 0.95,-1.3; 4 0.95,1.3; 5 -0.95,1.3
2X3 = drill 1.016 pad 1.88 octagon: 1 0,0; 2 0,2.54; 3 2.54,0; 4 2.54,2.54; 5 5.08,0; 6 5.08,2.54
7395-02 = drill 1.016 long: 1 1.27,0; 2 -1.27,0
RESONATOR-SMD = smd 0.7 x 1.7: 1 -1.2,0; 2 0,0; 3 1.2,0
R0805 = smd 1.3 x 1.5: 1 -0.95,0; 2 0.95,0
R0805' = smd 1.1 x 1.4: 1 -1,0; 2 1,0
TACTILE-SWITCH-1101NE = smd 2.3 x 1.6: P$1 -3.15,0; P$2 3.15,0
CHIP-LED0805 = smd 1.2 x 1.2: A 0,-1.05; C 0,1.05
TO-92 = drill 0.813 pad 1.27 octagon: 1 -1.27,0; 2 0,1.905; 3 1.27,0
4,5-PAD = drill 4.5 pad 9: B4,5 0,0
USB-MB-H = drill 0.8: D+ 5.1,0; D- 3.9,0.8; GND 5.1,-1.6; ID 3.9,-0.8; VBUS 5.1,1.6 | drill 1.9: P$6 0,-3.65; P$7 0,3.65
MICROSD = smd 0.7 x 1.5: 1 9,-10.64; 2 7.9,-10.24; 3 6.8,-10.64; 4 5.7,-11.04; 5 4.6,-10.64; 6 3.5,-11.04; 7 2.4,-10.64; 8 1.3,-10.64 | smd 1.8 x 1.4: CD1 2,-0.44; CD2 8,-0.44 | smd 1.4 x 1.9: MT1 0.4,-13.54; MT2 13.6,-14.44

### Placement (x,y rotation side)
ACS711  40.37,47.89 90 top
AP1117  5.08,17.91 180 top
ATMEGA2560  28.01,35.69 0 top
AUX  53.59,28.96 270 top
BANCO  26.16,55.75 270 top
BAT  9.65,50.14 270 bottom
BLE  35.05,55.75 270 top
C1  5.07,12.29 0 top
C2  25.4,20.45 270 top
C3  6.86,7.75 180 top
C4  1.9,8.82 270 top
C5  12.32,19.3 180 bottom
C6  33.02,3.17 90 bottom
C7  32.03,47.33 0 top
C8  0.1uF  [C0805K']  37.72,7.62 0 bottom
C10  8.26,3.56 90 top
C11  4.57,7.75 0 top
DBG_L  41.91,3.94 90 top
DS3231  8.89,30.61 270 bottom
FRAME1  7.62,-12.57 0 top  (outside the outline)
FT232RL  19.05,15.88 180 top
GPS  16.13,49.28 270 top
IC1  24.13,20.45 0 bottom
IC2  37.85,11.18 0 bottom
ISP  48.13,26.42 90 top
J1  11.52,13.52 0 top
OSC  26.67,23.62 180 top
PWR  37.72,3.94 270 top
R1  41.91,7.75 0 top
R2  19.05,22.99 90 top
R3  38.1,7.75 180 top
R4  12.95,21.46 180 bottom
R5  16.51,22.99 90 top
R6  29.21,7.75 0 top
R7  33.02,7.75 180 top
R8  27.94,20.45 270 top
R9  11.94,17.02 180 top
R10  1K  [R0805']  27.43,4.06 270 bottom
R13  31.97,49.33 0 top
R14  20.88,48.39 270 top
R15  22.76,48.39 270 top
RX  33.02,3.94 90 top
S1  49.53,7.75 180 top
SD  46.48,3.94 90 top
TEMP  39.5,17.02 0 bottom
TX  29.21,3.94 90 top
U$1  [LOGO_CIL]  57.78,5.21 0 bottom
U$2  [LOGO_ELIBATT]  42.55,55.12 270 bottom
U$4  [LOGO_ELIBATT2]  3.68,32.13 0 top
V_IN  48,40.4 0 top
V_OUT  48,55.4 0 top
X1  19.56,4.06 90 bottom
X2  41.66,10.79 90 top

### Tracks (layer width: path | path; a pad name or v marks a point on that pad's centre or on a via)
+3V3  (via drill 0.6)
  Top 0.406: v35.31,15.62 44.07,15.49 45.09,14.35 48.9,14.35 50.93,16.38 52.71,16.51 X2.4
  Bottom 0.305: C6.+ 33.02,8.64 34.16,9.78 34.29,9.78 | 34.29,9.78 35.31,9.78 36.7,11.18 38.23,11.18 38.23,11.91 IC2.5 | IC1.1 28.57,17.27 34.29,11.56 34.29,9.78 | 38.8,13.02 36.96,14.86 36.83,14.86 v35.31,15.62
  Bottom 0.406: IC2.5 38.8,13.02
ANALOG_AUX  (via drill 0.6)
  Top 0.305: ATMEGA2560.89 27.51,41.23 26.54,40.26 v25.91,40.26 | v50.04,33.27 53.09,33.27 53.59,32.77 AUX.1
  Bottom 0.305: v25.91,40.26 25.91,36.2 27.56,34.54 29.72,34.54 29.97,34.29 32.89,34.29 33.15,34.04 35.18,34.04 37.34,31.88 37.34,31.11 37.97,30.48 41.53,30.48 42.04,30.99 43.18,30.99 43.81,31.62 43.81,32.39 44.7,33.27 v50.04,33.27
BT_RX  (via drill 0.6)
  Top 0.305: v36.83,43.69 36.83,43.56 37.47,42.93 37.47,36.58 36.7,36.2 ATMEGA2560.64
  Bottom 0.305: BLE.1 34.04,59.56 32.64,58.17 32.64,56.77 33.66,55.75 36.83,55.75 37.21,55.5 37.21,44.7 36.7,43.69 v36.83,43.69
BT_TX  (via drill 0.6)
  Top 0.305: ATMEGA2560.63 37.08,35.69 37.97,36.2 v37.97,43.94
  Bottom 0.305: v37.97,43.94 37.97,55.75 37.34,56.26 34.8,56.9 BLE.2
COMM_RX  (via drill 0.6)
  Top 0.305: ATMEGA2560.46 32.01,28.71 32.64,29.34 33.02,29.34 v33.15,29.46 | v33.15,31.88 33.15,38.23 v32.38,38.99
  Bottom 0.305: v33.15,29.46 v33.15,31.88 | v32.38,38.99 32.51,47.24 29.84,49.91 29.84,58.8 29.08,59.56 BANCO.1
COMM_TX  (via drill 0.6)
  Top 0.305: ATMEGA2560.45 31.51,29.45 v31.5,29.46 | v31.5,31.88 31.5,38.23 v30.99,38.73
  Bottom 0.305: v31.5,29.46 v31.5,31.88 | v30.99,38.73 30.99,46.99 28.83,49.15 28.83,56.39 28.19,57.02 BANCO.2
DIGITAL1_AUX  (via drill 0.6)
  Top 0.305: ATMEGA2560.6 22.28,39.19 22.73,38.73 v27.18,38.73
  Bottom 0.305: v27.18,38.73 29.34,38.73 31.11,36.96 35.43,36.96 36.7,35.69 36.7,35.05 36.96,34.8 53.72,34.8 55.5,32.89 55.5,29.97 55.24,29.72 AUX.2
DIGITAL2_AUX  (via drill 0.6)
  Top 0.305: ATMEGA2560.7 21.89,38.69 22.35,38.23 26.42,38.23 v27.05,37.59
  Bottom 0.305: v27.05,37.59 29.34,37.59 30.73,36.2 35.05,36.2 36.07,35.18 36.07,34.42 36.32,34.29 50.67,34.29 51.31,33.53 51.31,27.69 51.69,27.18 AUX.3
DTR
  Top 0.254: FT232RL.2 22.62,18.14 22.99,17.65 23.99,17.65 C2.2
GND  (via drill 0.6)
  Top 0.254: ATMEGA2560.81 31.51,42.69 30.86,41.78 v29.21,41.78
  Top 0.305: ATMEGA2560.99 22.51,45.31 | v18.41,18.03 17.27,18.03 16.76,18.54 16.77,18.55 FT232RL.11 | OSC.2 26.67,22.99 27.3,22.35 28.96,22.35 29.46,22.86 v29.84,22.86 | 22.86,21.84 22.86,23.37 23.5,24 23.88,24 25.02,25.15 ATMEGA2560.32 v25.01,29.58 v25.02,29.59 | 22.86,21.84 22.86,21.34 22.35,20.83 19.68,20.83 19.43,20.57 19.43,19.59 FT232RL.7 | v23.88,21.84 22.99,21.97 22.86,21.84 | ATMEGA2560.11 25.15,36.69 | 25.15,36.69 28.56,36.69 28.77,36.89 | 28.77,36.89 29.21,37.34 v29.21,41.78 | v25.02,35.81 25.02,36.56 25.15,36.69 | v34.67,35.43 34.92,35.19 ATMEGA2560.62 38.22,35.19 39.12,34.42 54.74,34.42 56.01,33.02 56.01,24.48 X2.MT2 | v30.23,35.43 28.77,36.89 | BLE.3 BANCO.3 | ATMEGA2560.81 31.51,41.13 31.75,40.89 33.02,41.28 v33.4,41.15
  Top 0.406: C7.2 34.16,47.33 v34.29,47.37 | v35.56,49.66 35.7,49.79 ACS711.5 | 16,13.97 14.22,13.97 13.77,13.52 J1.1 12.79,14.52 12.45,14.86 11.68,14.86 11.05,15.49 11.05,15.37 10.79,15.62 9.53,15.62 | 16,13.97 16.76,13.21 16.76,12.23 FT232RL.18 16.77,11.29 17.02,11.05 18.41,11.05 | 18.41,11.05 18.67,11.3 18.67,12.16 FT232RL.21 18.73,11.25 18.92,11.05 21.08,11.05 21.34,11.3 | 21.34,11.3 21.34,12.21 FT232RL.25 | FT232RL.26 21.98,11.18 21.84,11.05 21.59,11.05 21.34,11.3 | 18.41,11.05 18.41,9.62 X1.GND | 9.53,15.62 9.14,15.37 9.14,15.11 8.51,14.48 8.51,13.21 7.62,12.32 6.1,12.32 C1.2 6.1,12.26 6.1,11.18 6.6,10.67 v6.6,10.79 | 16,13.97 v16,14.61 | FT232RL.7 19.38,18.36 v18.41,18.03 | FT232RL.11 16.77,20.56 16.64,20.7 14.35,20.7 14.22,20.57 v13.97,19.18 | C3.2 6.21,6.33 v6.1,6.22 5.46,6.86 4.7,6.86 | 7.74,2.03 v5.59,2.03 5.59,2.18 C10.- | C4.2 2.09,7.82 2.54,6.86 4.7,6.86 | C11.2 5.35,7 4.7,6.86 | 9.53,15.62 v9.53,16.76 | v9.4,20.95 7.44,20.95 AP1117.1 | DBG_L.C PWR.C 39.15,2.32 39.24,2.41 | 39.24,2.41 v35.81,2.41 | 39.24,2.41 51.94,2.41 52.07,5.21 52.68,5.82 S1.P$1 53.85,7.75 55.24,9.14 55.24,11.15 X2.MT1 56.79,11.2 v56.9,11.3 | v56.13,21.97 56.1,22.01 X2.MT2 v52.45,24.38 | v55.12,14.22 52.77,14.22 X2.6 | R15.1 22.76,53.5 23.75,54.48 BANCO.3 | R15.1 22.76,50.64 22.35,51.05 19.43,51.05 17.91,49.53 17.91,48.13 17.78,48.01 GPS.3 14.1,48.01 13.72,47.62 13.72,45.15 BAT.- | 22.51,45.31 v22.35,45.47 | v24.38,47.5 24.38,49.02 24.13,49.28 22.82,49.28 R15.1 | v43.69,24.38 43.18,25.15 43.18,30.73 43.69,31.5 ISP.6
  Bottom 0.305: v35.81,2.41 33.04,1.78 | v29.21,41.78 29.21,43.69 26.04,46.86 v24.38,47.5 | v29.84,22.86 29.97,22.73 29.97,21.46 29.72,21.21 27.05,21.21 26.04,22.22 | 26.04,22.22 IC1.14 | IC1.11 22.23,22.35 22.73,22.1 23.75,22.1 v23.88,21.84 25.78,21.84 26.04,22.22 | v25.02,29.59 v25.02,35.81 | v34.67,35.43 v30.23,35.43 | v33.4,41.15 36.2,44.32 36.2,46.48 35.56,47.12 34.54,47.12 v34.29,47.37
  Bottom 0.406: v34.29,47.37 35.56,48.51 v35.56,49.66 | v16,14.61 16.38,14.61 18.8,17.02 19.05,17.02 | 19.05,17.02 19.33,17.02 IC1.8 | v18.41,18.03 18.8,17.27 19.05,17.02 | v13.97,19.18 C5.2 | v6.6,10.79 6.1,10.03 v6.1,6.22 6.1,2.54 v5.59,2.03 | v9.53,16.76 9.65,20.7 v9.4,20.95 9.4,28.7 8.13,29.97 DS3231.15 | 33.04,1.78 C6.- | 36.72,6.48 C8.2 36.7,7.64 36.7,8.64 36.96,8.89 37.34,8.89 37.85,9.4 IC2.2 | 36.72,6.48 36.72,6.11 35.81,5.21 v35.81,2.41 | TEMP.1 41.15,6.86 40.13,5.97 37.23,5.97 36.72,6.48 | v56.13,21.97 56.13,15.24 v55.12,14.22 56.9,12.45 v56.9,11.3 | v22.35,45.47 v24.38,47.5 | v52.45,24.38 v43.69,24.38
  pour Bottom: 58.29,35.18 58.41,0.45 arc-89 58.3,-0.04 -0.17,0.08 arc-90 -0.13,0.17 -0.19,61.1 38.84,60.91 38.96,35.25
  pour Top (isolate 0.2): 58.29,35.18 58.42,0.13 0,0.13 0,58.98 arc-90 2.1,61.09 39.34,60.96 39.34,35.05
GPS_RX  (via drill 0.6)
  Top 0.254: 18.41,35.69 ATMEGA2560.13
  Top 0.305: 18.41,35.69 20.32,35.69 | v17.53,35.69 ATMEGA2560.13
  Bottom 0.406: v17.53,35.69 17.78,37.59 17.27,38.1 13.59,38.1 12.57,39.12 12.57,52.45 13.21,53.09 GPS.1
GPS_TX  (via drill 0.6)
  Top 0.305: ATMEGA2560.12 18.55,36.19 18.29,36.45 11.56,36.45 v11.43,36.32
  Bottom 0.305: v11.43,36.32 11.43,52.58 14.22,55.37 17.02,55.37 18.67,53.72 18.67,51.44 17.53,50.29 16.38,50.29 GPS.2
IP+  (via drill 0.4)  (33 unrouted)
  other vias: 45,46.4 46.88,46.52 48.37,46.26 50.75,46.52 52.88,46.52 55.42,46.26 53.77,43.09 53.31,40.05 55.8,37.75 55.04,41.82 55.8,39.91 52.63,44.65 54.51,44.64 56.1,43.75 44,44.4 41.5,43.9 41.88,41.14 43,42.4 41.12,46.82 42.13,39.64 41.5,37.9 41.5,36.02 44,36.4 45.5,37.9 44.5,40.4 45.5,42.9 48,43.9 50.5,42.9 51.5,40.4 50.5,37.9 48,36.9
IP-  (via drill 0.4)  (32 unrouted)
  other vias: 41.5,59.9 43.11,59.78 41.5,57.9 42.37,57.02 42.87,58.54 41.5,55.9 43,53.4 41.5,53.9 41.5,51.9 41.17,49.02 44,51.4 45.5,52.9 46,50.4 45,49.4 46.5,48.9 48,51.9 44.5,55.4 45.5,57.9 48,58.9 50.5,57.9 51.5,55.4 50.5,52.9 52.5,59.9 55.04,58.63 53.77,56.09 53.77,53.55 53.9,50.88 55.55,49.48 55.67,52.28 55.8,55.07
MISO  (via drill 0.51, 0.6)
  Top 0.254: 45.72,12.63 45.52,12.83 44.45,12.83 43.56,14.1 v36.07,13.84 | ATMEGA2560.22 20.76,31.19 21.46,30.99 28.45,30.99 v29.59,29.97 | ISP.1 52.07,22.99 53.34,22.99 57.15,19.18 57.15,14.86 55.63,13.21
  Top 0.305: 55.63,13.21 54.61,13.2 X2.7 52.28,13.21 50.55,13.21 49.97,12.63 45.72,12.63 | v11.56,35.05 15.88,35.05 16.76,34.04 v16.76,33.27 | v16.76,30.73 17.4,31.11 ATMEGA2560.22
  Bottom 0.305: DS3231.19 v11.56,35.05 | v16.76,33.27 v16.76,30.73
  Bottom 0.406: v36.07,13.84 34.29,14.73 32.13,17.14 32.13,25.65 31.24,26.54 31.24,27.81 v29.59,29.97
MOSI  (via drill 0.6)
  Top 0.254: 19.05,31.69 ATMEGA2560.21 18.73,31.69
  Top 0.305: v7.11,31.62 18.68,31.62 ATMEGA2560.21 29.4,31.69 | v23.62,15.88 26.67,15.88
  Top 0.406: 26.67,15.88 28.19,17.53 32.64,17.53 v35.81,20.7 | v38.35,23.24 v41.53,26.42 | 29.4,31.69 30.61,30.35 33.78,30.35 36.32,27.94 37.08,27.94 v37.85,28.7
  Bottom 0.305: IC1.5 v23.62,15.88 | v7.11,31.62 6.73,32.51 DS3231.17
  Bottom 0.406: v35.81,20.7 v38.35,23.24 | ISP.4 44.32,28.96 v41.53,26.42 41.4,28.07 40.77,28.7 v37.85,28.7
N$1
  Bottom 0.406: BAT.+ 9.63,48.87 1.65,38.23 1.65,32.26 2.67,31.24 DS3231.16
N$2
  Top 0.254: ATMEGA2560.34 26.01,26.73 26.58,26.16 27.43,26.16 27.87,25.72 OSC.1
N$3
  Top 0.254: R1.2 42.96,7.65 DBG_L.A
N$4  (via drill 0.6)
  Top 0.305: ATMEGA2560.26 21.97,27.05 v21.21,27.56
  Top 0.406: R1.1 40.96,8.58 42.04,9.65 43.69,9.65 v43.94,9.91
  Bottom 0.305: 21.72,28.19 v21.21,27.56
  Bottom 0.406: v43.94,9.91 43.94,19.81 43.18,20.57 41.27,20.57 40.64,21.08 40.64,27.05 40.26,27.56 37.72,27.69 36.2,29.21 34.42,32.77 29.21,32.77 26.04,28.19 21.72,28.19
N$5
  Top 0.254: PWR.A 37.08,3.94 37.08,5.46 37.47,5.84 38.73,5.84 38.99,6.1 38.99,7.69 R3.1
N$6  (via drill 0.6)
  Top 0.305: R2.1 21.52,22.04 v21.84,21.59 | v23.5,20.83 23.62,20.7 23.37,20.7 23.37,19.62 FT232RL.1
  Bottom 0.305: v21.84,21.59 v23.5,20.83
N$7
  Bottom 0.406: R4.1 12,23.05 11.68,23.37 11.68,30.86 12.06,31.24 DS3231.5
N$8
  Top 0.305: R5.1 16.32,21.84 14.61,21.84 13.08,20.32 12.57,19.18 13.34,18.41 16,18.41 16.26,18.16 16.26,18.03 17.53,16.76 19.05,16.76 19.18,16.89 20.19,16.89 20.68,17.37 FT232RL.5
N$9  (via drill 0.6)
  Top 0.305: SD.A 47.88,5.21 47.62,5.46 46.35,5.46 45.85,6.22 v43.81,6.22 | v37.72,1.4 30.61,1.4 v29.34,1.78
  Top 0.406: v34.29,13.21 34.04,13.21 31.88,11.05 30.61,11.05 30.1,11.56 27.69,11.56 v27.56,11.68
  Bottom 0.305: v43.81,6.22 43.56,5.46 43.56,5.08 43.94,4.83 43.94,2.54 43.05,1.4 v37.72,1.4 | v29.34,1.78 29.34,6.48
  Bottom 0.406: IC1.10 20.95,21.08 21.46,19.81 28.07,19.81 30.35,17.65 30.35,17.14 v34.29,13.21 | v27.56,11.68 27.56,9.65 26.67,8.76 26.67,7.24 27.43,6.48 29.34,6.48
N$10  (via drill 0.51)
  Top 0.254: FT232RL.22 19.38,13.66 v20.45,14.35 | v31.11,6.22 31.11,5.17 31.97,4.32 RX.C
  Bottom 0.254: 26.04,14.35 31.11,9.27 v31.11,6.22
  Bottom 0.305: v20.45,14.35 26.04,14.35
N$11
  Top 0.254: R7.1 34.07,7.65 RX.A
N$12  (via drill 0.51)
  Top 0.254: FT232RL.23 20.02,13.32 20.42,13.59 v23.37,13.59 | 27.94,4.19 27.94,4.16 | 27.94,4.16 26.04,6.06 v26.04,6.1 | 27.94,4.16 TX.C
  Bottom 0.254: v23.37,13.59 24.38,13.59 26.04,11.94 v26.04,6.1
N$13
  Top 0.254: TX.A 28.26,5.94 R6.1
N$14
  Top 0.254: ATMEGA2560.33 25.51,25.92 25.47,25.46 OSC.3
N$15  (via drill 0.6)
  Top 0.305: v29.72,14.73 43.81,14.73
  Top 0.406: 43.81,14.73 44.7,13.59 45.97,13.59 46.1,13.46 49.78,13.46 50.04,13.72 50.04,14.1 51.31,15.37 52.27,15.37 X2.5
  Bottom 0.305: 27.3,16.64 v29.72,14.73
  Bottom 0.406: IC1.2 27.3,16.64
N$16  (via drill 0.6)
  Top 0.305: 27.05,15.11 v22.86,15.11
  Top 0.406: X2.2 50.32,18.7 48.39,16.76 45.85,16.76 45.59,17.02 45.59,20.07 44.58,21.21 37.59,21.21 33.15,16.76 28.57,16.76 27.05,15.11
  Bottom 0.305: 19.94,15.11 21.84,15.11 22.1,15.24 | 22.1,15.24 22.1,17.25 | v22.86,15.11 22.61,15.24 22.1,15.24
  Bottom 0.406: R10.1 25.67,5.06 25.27,5.46 25.27,11.94 24.38,12.83 20.07,12.83 19.3,13.59 19.3,14.61 19.94,15.11 | 22.1,17.25 IC1.6
N$17  (via drill 0.6)
  Top 0.305: v44.7,5.33 45.47,5.33 45.85,4.95 SD.C
  Bottom 0.305: R10.2 27.43,1.78 28.57,0.51 43.43,0.51 44.58,2.41 44.58,5.08 v44.7,5.33
N$18  (via drill 0.6)
  Top 0.406: X2.3 50.74,17.59 48.51,15.37 45.72,15.37 43.56,17.53 43.56,19.94 42.93,20.57 38.1,20.57 33.4,15.88 29.21,15.88 v27.69,13.97
  Bottom 0.406: v27.69,13.97 27.56,13.72 26.29,14.99 25.02,14.99 24.77,15.24 IC1.4
N$19
  Top 0.305: FT232RL.17 16.12,13.09 15.24,13.46 14.35,13.21 14.1,12.57
  Top 0.406: 14.1,12.57 13.97,11.56 13.72,11.05 9.78,11.05 7.87,9.14 4.45,9.14 3.94,8.64 3.94,7.76 C11.1
N$20
  Bottom 0.406: 2.54,6.48 2.54,7.75 3.81,7.75 3.81,6.48 5.08,6.48
N$21
  Bottom 0.406: 2.54,9.02 3.81,9.02 3.81,10.29 5.08,10.29 5.08,9.02
N$22
  Bottom 0.406: 5.08,12.83 3.3,12.83 2.67,12.19 3.3,11.56 5.08,11.56
N$35  (via drill 0.4)
  other vias: 53.01,36.79
N$37  (via drill 0.4)
  other vias: 52.5,48.9
N$58  (via drill 0.4)
  other vias: 50.5,48.9
N$59  (via drill 0.4)
  other vias: 48.5,48.9
N$61  (via drill 0.4)
  other vias: 50,50.4
N$69
  Top 0.254: R13.2 32.99,49.4 34.2,49.4 35.08,48.52 ACS711.6
N$70  (via drill 0.4)
  other vias: 52,51.4
RAW
  Top 0.254: 2.54,20.78 AP1117.3
  Top 0.305: AP1117.3 2.77,19.79 1.78,18.8 1.78,9.94 7.54,9.94 9.23,11.63 J1.2
  Top 0.406: AP1117.3 2.77,37.19 3.81,38.23 13.97,38.23 15.24,39.5 16.13,39.5 16.38,39.75 16.38,42.55 17.27,43.43 18.41,43.43 18.41,47.24 19.56,49.28 20.82,49.28 R14.1
  Top 1.5: 1.78,9.94 C4.1
RST  (via drill 0.51, 0.6)
  Top 0.254: ISP.5 47.62,33.4 43.43,33.4 42.42,32.13 v42.42,22.1 42.29,22.1 41.91,21.72 31.24,21.72 28.26,21.72 R8.1 25.45,21.4 C2.1 | S1.P$2 46.99,8.1 v46.99,11.56
  Top 0.305: ATMEGA2560.30 24,28.45 24,30.48 27.81,30.48 v28.32,29.84 | v31.24,23.24 31.24,21.72
  Bottom 0.254: v42.42,22.1 46.61,22.1 46.99,21.72 v46.99,11.56
  Bottom 0.305: v28.32,29.84 28.57,29.34 30.48,27.56 30.48,26.16 31.24,25.4 v31.24,23.24
RTC  (via drill 0.6)
  Top 0.305: 29.73,32.26 29.73,32.25 30.86,30.99 34.42,30.99 34.67,31.75 34.68,32.13 ATMEGA2560.56
  Top 0.406: v21.72,34.8 25.02,34.8 28.57,32.26 29.73,32.26
  Bottom 0.305: 16.51,35.69 16.51,35.31 17.02,34.8 v21.72,34.8
  Bottom 0.406: DS3231.1 15.88,36.32 16.51,35.69
RX_FT232  (via drill 0.51)
  Top 0.254: R5.2 16.51,24.89 v17.71,26.22 | v23.11,39.78 23.11,39.82 22.7,40.74 22.45,40.74 20.47,40.69 ATMEGA2560.3
  Bottom 0.254: v23.11,39.78 23.11,32 v17.71,26.22
SCK  (via drill 0.6)
  Top 0.305: v26.29,32.77 22.23,32.77 21.21,32.26 ATMEGA2560.20 16.26,32.13 15.24,33.15 | v11.43,33.78 12.32,33.15 15.24,33.15 | v15.62,33.91 15.24,33.15
  Bottom 0.305: 19.68,20.19 20.7,18.92 | v26.29,32.77 28.07,32.77 28.7,33.4 34.8,33.4 35.31,32.89 35.31,32.77 36.58,31.5 36.58,30.35 37.21,29.72 41.66,29.72 42.04,29.34 43.56,29.34 44.45,30.23 46.86,30.23 ISP.3 | DS3231.18 v11.43,33.78 | IC1.9 18.29,23.49 17.4,22.73 17.4,17.53 16.51,16.51 15.11,16.51 14.73,17.27 14.73,18.54 15.11,19.68 15.11,24.89 16.51,26.42 16.64,29.21 15.75,30.1 15.62,32.77 v15.62,33.91
  Bottom 0.406: IC1.9 19.68,20.19 | 20.7,18.92 25.65,19.05 26.04,18.67 IC1.3 | DS3231.20 2.92,36.32 2.54,35.94 2.54,34.16 2.92,33.78 DS3231.18
SD  (via drill 0.6)
  Top 0.305: 33.53,26.16 34.04,26.67 34.06,26.67 ATMEGA2560.50
  Top 0.406: v8.51,28.32 19.81,28.32 20.32,27.18 20.32,26.54 21.84,26.16 v22.1,26.16 | v28.96,26.16 33.53,26.16
  Bottom 0.406: IC1.7 20.95,16.13 20.57,15.75 18.54,15.75 16.38,13.59 15.62,13.59 14.99,14.22 14.99,14.86 14.35,15.49 9.14,15.49 8.51,16.13 v8.51,28.32 | v22.1,26.16 28.83,26.04 v28.96,26.16
SENSOR_CURRENT  (via drill 0.4, 0.6)
  Top 0.254: ACS711.7 35.66,47.25 34.07,45.92 v24.68,45.92 | ATMEGA2560.97 23.51,42.66 24,41.91 24.25,41.78 v24.3,41.99
  Bottom 0.254: v24.3,41.99 24.3,44.78 v24.68,45.92
SENSOR_VOLT
  Top 0.254: ATMEGA2560.96 24.01,45.38 R15.2 R14.2
TEMP  (via drill 0.6)
  Top 0.305: 38.61,33.15 37.32,33.15 ATMEGA2560.58
  Top 0.406: 38.61,33.15 39.37,32.39 v39.37,25.53 39.12,25.27 v29.72,25.27 | R9.1 v15.75,17.27
  Bottom 0.406: TEMP.2 v39.37,25.53 | v15.75,17.27 15.75,23.24 17.78,25.27 v29.72,25.27
TX_FT232  (via drill 0.51, 0.6)
  Top 0.254: R2.2 v19.05,26.42 | ATMEGA2560.2 20.81,41.19 v23.31,41.23
  Bottom 0.254: v19.05,26.42 24.13,31.88 24.13,39.11 24.04,39.45 v23.31,41.23
USB_D+1
  Top 0.406: X1.D+ 19.56,9.78 20.07,10.29 23.37,10.29 24.13,9.53 24.13,6.98 23.5,6.1 15.49,6.1 14.86,6.98 14.86,11.68 FT232RL.15
USB_D-1
  Top 0.406: X1.D- 20.86,7.96 21.46,7.37 21.34,6.73 16,6.73 15.49,7.62 15.49,11.69 FT232RL.16
VCC  (via drill 0.5, 0.6)
  Top 0.254: R6.2 R7.2 | R13.1 C7.1
  Top 0.305: 7.75,7.62 7.75,7.75 C3.1 7.62,7.62 7.75,7.62 | 7.75,7.62 7.75,5.33 7.62,4.57 6.35,4.57 5.08,2.67 v2.54,2.67 | C1.1 4.19,14.48 | 4.19,14.48 AP1117.4 | 4.19,14.48 4.06,14.61 v4.06,16.64 5.02,17.83 5.08,17.91 AP1117.2 | ACS711.8 35.94,45.97 35.05,45.09 31.75,45.09 | 31.75,45.09 32.01,45.08 ATMEGA2560.80 32.01,42.16 34.42,42.16 34.04,39.88 33.78,34.67 35.99,34.67 ATMEGA2560.61 37.96,34.69 40.13,32.51 41.78,32.51 42.93,33.91 48.51,33.91 50.04,32 50.16,28.7 v50.29,28.32 | 31.75,45.09 v29.72,45.09 | v28.7,47.37 28.75,47.33 C7.1 | R3.2 37.15,8.07 38.1,9.02 39.75,9.02 v40.13,9.27 | ATMEGA2560.98 23.01,42.57 22.86,42.42 22.23,42.42 22.1,42.55 22.1,42.67 21.97,42.8 21.97,42.93 | 21.97,42.93 21.97,43.65 | 21.97,43.65 ATMEGA2560.100 | 10.64,37.19 ATMEGA2560.10 19.07,37.19 18.41,37.85 18.41,41.66 19.68,42.93 21.97,42.93 | 21.97,43.65 21.08,45.47 | ATMEGA2560.31 24.51,25.53 24,24.89 20.95,24.89 19.81,26.04 19.81,26.8 19.43,27.18 16.26,27.18 15.71,26.47 | 15.71,26.47 13.97,24.77 v13.97,23.24 | v15.49,27.3 15.71,26.47
  Top 0.406: 5.02,17.83 5.6,18.41 v10.54,18.54 10.54,17.4 10.67,17.27 R9.2 11.75,16.06 12.19,15.75 18.67,16 | X1.VBUS 22.84,9.16 v22.86,9.14 | v24.38,10.67 29.08,10.67 30.23,9.53 30.23,7.81 R6.2 | 21.34,17.78 21.34,17.14 20.57,16.38 19.81,16.38 19.43,16 18.67,16 | FT232RL.4 21.34,19.01 21.34,17.78 | FT232RL.20 18.07,13.38 v18.03,13.72 18.03,14.61 18.41,14.99 18.41,15.75 18.67,16 | R3.2 35.94,7.75 35.56,8.13 v35.56,8.76 34.92,9.4 32.38,9.4 32.07,9.08 R7.2 | 21.34,17.78 21.97,17.14 24.26,17.14 25.27,18.16 27.69,18.16 27.94,18.41 R8.2 | 10.64,37.19 10.29,36.83 10.29,33.02 v10.79,32.51 | 21.08,45.47 v19.43,45.47 | v31.11,51.05 31.11,49.42 R13.1 | BANCO.4 26.16,48.13 v26.92,47.37 v28.7,47.37 | C10.+ 7.62,4.93 7.62,4.57
  Bottom 0.305: v2.54,2.67 1.27,3.94 1.27,15.37 3.17,17.02 3.68,17.02 v4.06,16.64 | v29.72,45.09 28.7,46.1 v28.7,47.37 | IC2.1 38.89,9.78 39.5,9.78 39.88,9.4 v40.13,9.27 39.88,8.38 39.12,7.62 C8.1 | C5.1 12.05,19.92 12.19,20.07 13.72,20.07 13.84,20.19 13.84,21.4 | v13.97,23.24 R4.2 | v15.49,27.3 15.62,27.56 15.62,28.83 15.11,29.34 15.11,32.51 DS3231.4 v10.79,32.51 | v26.92,47.37 24.64,49.66 24.64,50.16 23.88,50.93 19.68,50.93 19.43,50.67 19.43,45.97 18.92,45.47 | v50.29,28.32 50.16,25.91 48.77,25.02 46.35,25.02 45.47,26.16 ISP.2
  Bottom 0.406: 13.84,21.4 R4.2 | v10.54,18.54 10.54,18.8 10.92,19.18 C5.1 | v22.86,9.14 v24.38,10.67 24.26,10.79 24.26,11.3 23.88,11.68 18.67,11.68 18.03,12.32 v18.03,13.72 | v35.56,8.76 35.56,9.14 36.2,9.78 36.8,9.78 IC2.3 | IC2.1 39.21,9.88 40.01,10.67 40.01,12.95 38.35,14.61 38.35,16.38 TEMP.3 | v19.43,45.47 18.92,45.47 GPS.4 | BLE.4 31.88,51.94 30.99,51.05 v31.11,51.05

### Text on the board
tNames: BLE | BANK | GPS | - | + | Eli-Batt | Eli-Batt | + | + | + | + | +
bNames: Tx1 | Tx3 | Rx1 | Rx3 | GND. | GND. | Tx2 | 5V. | 5V. | Rx2 | GND. | 5V. | A1 | D1 | D2